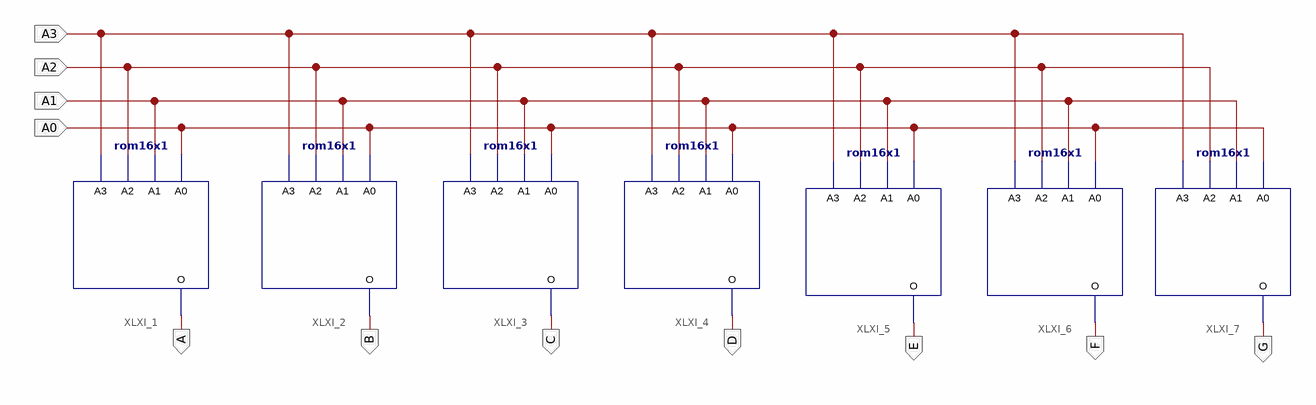
[diagram p0: schematic sheet 1]
// Xilinx ISE schematic LUT.sch (spartan3e) as structural Verilog: 7 symbols, 11 ports
module LUT (
  input  A3,
  input  A2,
  input  A1,
  input  A0,
  output A,
  output B,
  output C,
  output D,
  output E,
  output F,
  output G
);

  rom16x1 #(.INIT("2812")) XLXI_1 (.A0(A0), .A1(A1), .A2(A2), .A3(A3), .O(A));
  rom16x1 #(.INIT("D860")) XLXI_2 (.A0(A0), .A1(A1), .A2(A2), .A3(A3), .O(B));
  rom16x1 #(.INIT("D004")) XLXI_3 (.A0(A0), .A1(A1), .A2(A2), .A3(A3), .O(C));
  rom16x1 #(.INIT("8492")) XLXI_4 (.A0(A0), .A1(A1), .A2(A2), .A3(A3), .O(D));
  rom16x1 #(.INIT("02BA")) XLXI_5 (.A0(A0), .A1(A1), .A2(A2), .A3(A3), .O(E));
  rom16x1 #(.INIT("208E")) XLXI_6 (.A0(A0), .A1(A1), .A2(A2), .A3(A3), .O(F));
  rom16x1 #(.INIT("1083")) XLXI_7 (.A0(A0), .A1(A1), .A2(A2), .A3(A3), .O(G));
endmodule
